# Altium schematic sheet XMOS_TSBOARD_Power.SchDoc
size A3; DocumentNumber: 2; SheetNumber: 2; SheetTotal: 8
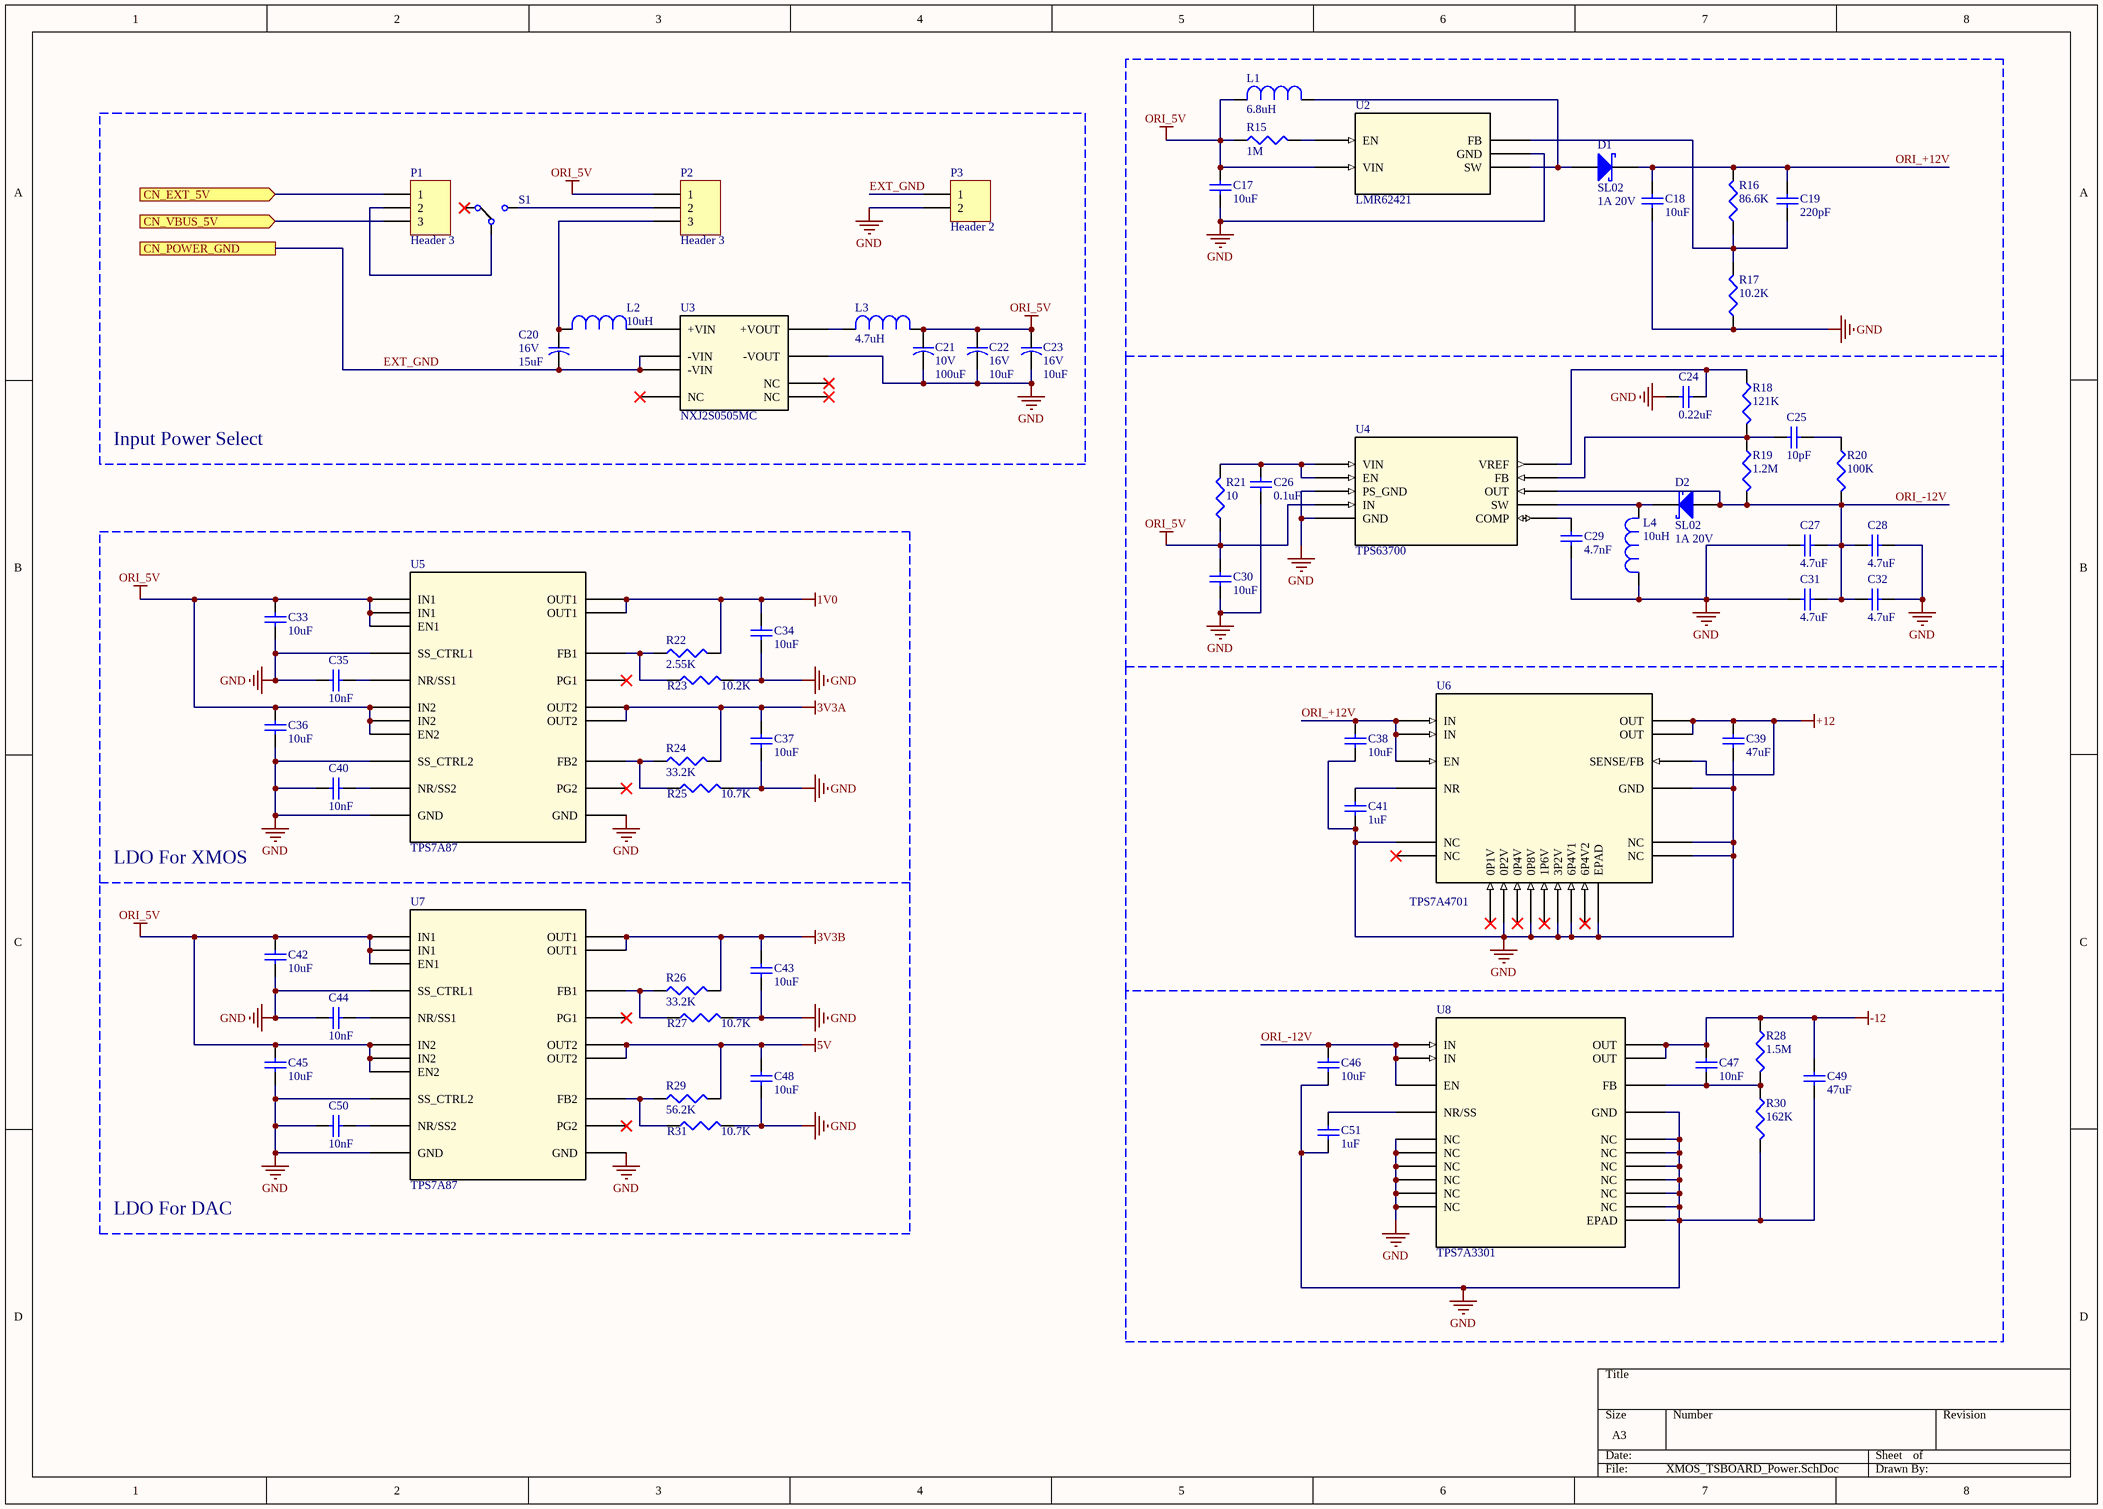
[diagram p0: XMOS_TSBOARD_Power.SchDoc]

## Parts
C17  value 10uF  [1608[0603]]  (hidden comment: Cap Semi)
C18  value 10uF  [C0805]  (hidden comment: Cap Semi)
C19  value 220pF  [1608[0603]]  (hidden comment: Cap Semi)
C20  value 15uF  RatedVoltage: 16V  [3528-21]  (hidden comment: KO-CAP)
C21  value 100uF  RatedVoltage: 10V  [3528-21]  (hidden comment: KO-CAP)
C22  value 10uF  RatedVoltage: 16V  [3528-21]  (hidden comment: KO-CAP)
C23  value 10uF  RatedVoltage: 16V  [3528-21]  (hidden comment: KO-CAP)
C24  value 0.22uF  [1608[0603]]  (hidden comment: Cap Semi)
C25  value 10pF  [1608[0603]]  (hidden comment: Cap Semi)
C26  value 0.1uF  [1608[0603]]  (hidden comment: Cap Semi)
C27  value 4.7uF  [C0805]  (hidden comment: Cap Semi)
C28  value 4.7uF  [C0805]  (hidden comment: Cap Semi)
C29  value 4.7nF  [1608[0603]]  (hidden comment: Cap Semi)
C30  value 10uF  [1608[0603]]  (hidden comment: Cap Semi)
C31  value 4.7uF  [C0805]  (hidden comment: Cap Semi)
C32  value 4.7uF  [C0805]  (hidden comment: Cap Semi)
C33  value 10uF  [1608[0603]]  (hidden comment: Cap Semi)
C34  value 10uF  [1608[0603]]  (hidden comment: Cap Semi)
C35  value 10nF  [1608[0603]]  (hidden comment: Cap Semi)
C36  value 10uF  [1608[0603]]  (hidden comment: Cap Semi)
C37  value 10uF  [1608[0603]]  (hidden comment: Cap Semi)
C38  value 10uF  [C0805]  (hidden comment: Cap Semi)
C39  value 47uF  [C1210]  (hidden comment: Cap Semi)
C40  value 10nF  [1608[0603]]  (hidden comment: Cap Semi)
C41  value 1uF  [1608[0603]]  (hidden comment: Cap Semi)
C42  value 10uF  [1608[0603]]  (hidden comment: Cap Semi)
C43  value 10uF  [1608[0603]]  (hidden comment: Cap Semi)
C44  value 10nF  [1608[0603]]  (hidden comment: Cap Semi)
C45  value 10uF  [1608[0603]]  (hidden comment: Cap Semi)
C46  value 10uF  [C0805]  (hidden comment: Cap Semi)
C47  value 10nF  [1608[0603]]  (hidden comment: Cap Semi)
C48  value 10uF  [1608[0603]]  (hidden comment: Cap Semi)
C49  value 47uF  [C1210]  (hidden comment: Cap Semi)
C50  value 10nF  [1608[0603]]  (hidden comment: Cap Semi)
C51  value 1uF  [1608[0603]]  (hidden comment: Cap Semi)
D1  SL02  value 1A 20V  [DO-219AB]
D2  SL02  value 1A 20V  [DO-219AB]
L1  value 6.8uH  [4240]  (hidden comment: SPM)
L2  value 10uH  [5250]  (hidden comment: SPM)
L3  value 4.7uH  [4240]  (hidden comment: SPM)
L4  value 10uH  [4240]  (hidden comment: SPM)
P1  Header 3  [HDR1X3]
P2  Header 3  [HDR1X3]
P3  Header 2  [HDR1X2]
R15  value 1M  [J1-0603]  (hidden comment: Res3)
R16  value 86.6K  [J1-0603]  (hidden comment: Res3)
R17  value 10.2K  [J1-0603]  (hidden comment: Res3)
R18  value 121K  [J1-0603]  (hidden comment: Res3)
R19  value 1.2M  [J1-0603]  (hidden comment: Res3)
R20  value 100K  [J1-0603]  (hidden comment: Res3)
R21  value 10  [J1-0603]  (hidden comment: Res3)
R22  value 2.55K  [J1-0603]  (hidden comment: Res3)
R23  value 10.2K  [J1-0603]  (hidden comment: Res3)
R24  value 33.2K  [J1-0603]  (hidden comment: Res3)
R25  value 10.7K  [J1-0603]  (hidden comment: Res3)
R26  value 33.2K  [J1-0603]  (hidden comment: Res3)
R27  value 10.7K  [J1-0603]  (hidden comment: Res3)
R28  value 1.5M  [J1-0603]  (hidden comment: Res3)
R29  value 56.2K  [J1-0603]  (hidden comment: Res3)
R30  value 162K  [J1-0603]  (hidden comment: Res3)
R31  value 10.7K  [J1-0603]  (hidden comment: Res3)
S1  SSSS213202  [SS_SMD_213202]  (value not drawn)
U2  LMR62421  [DBV5]
U3  NXJ2S0505MC  [SMD_NXJ2S0505]
U4  TPS63700  [DRC10]
U5  TPS7A87  [RTJ20]
U6  TPS7A4701  [RGW20]
U7  TPS7A87  [RTJ20]
U8  TPS7A3301  [RGW20]

## Blocks framed on the sheet
Input Power Select: C20-C23 L2 L3 P1-P3 S1 U3
LDO For XMOS: C33-C37 C40 R22-R25 U5
LDO For DAC: C42-C45 C48 C50 R26 R27 R29 R31 U7

## Ports
CN_EXT_5V (in), CN_POWER_GND, CN_VBUS_5V (in)

## Nets
1V0: C34.2 R22.2 U5.14(OUT1) U5.15(OUT1)
3V3A: C37.2 R24.2 U5.11(OUT2) U5.12(OUT2)
3V3B: C43.2 R26.2 U7.14(OUT1) U7.15(OUT1)
5V: C48.2 R29.2 U7.11(OUT2) U7.12(OUT2)
+12: C39.2 U6.1(OUT) U6.3(SENSE/FB) U6.20(OUT)
-12: C47.1 C49.2 R28.1 U8.1(OUT) U8.20(OUT)
GND: C17.1 C18.1 C21.2 C22.2 C23.2 C24.2 C26.1 C27.2 C28.1 C29.2 C30.1 C31.2 C32.1 C33.1 C34.1 C35.1 C36.1 C37.1 C38.1 C39.1 C40.1 C41.1 C42.1 C43.1 C44.1 C45.1 C46.1 C48.1 C49.1 C50.1 C51.1 L4.2 P3.2 R17.1 R23.2 R25.2 R27.2 R30.2 R31.2 U2.2(GND) U3.5(-VOUT) U4.2(GND) U4.7(PS_GND) U5.3(GND) U5.8(SS_CTRL2) U5.13(GND) U5.18(SS_CTRL1) U6.5(6P4V1) U6.6(3P2V) U6.7(GND) U6.9(0P8V) U6.11(0P2V) U6.17(NC) U6.18(NC) U6.19(NC) U6.21(EPAD) U7.3(GND) U7.8(SS_CTRL2) U7.13(GND) U7.18(SS_CTRL1) U8.2(NC) U8.4(NC) U8.5(NC) U8.6(NC) U8.7(GND) U8.8(NC) U8.9(NC) U8.10(NC) U8.11(NC) U8.12(NC) U8.17(NC) U8.18(NC) U8.19(NC) U8.21(EPAD)
ORI_5V: C17.2 C21.1 C22.1 C23.1 C30.2 C33.2 C36.2 C42.2 C45.2 L1.2 L3.1 P2.1 R15.1 R21.1 U2.5(VIN) U4.5(IN) U5.1(IN1) U5.2(IN1) U5.4(IN2) U5.5(IN2) U5.6(EN2) U5.20(EN1) U7.1(IN1) U7.2(IN1) U7.4(IN2) U7.5(IN2) U7.6(EN2) U7.20(EN1)
CN_EXT_5V: P1.1 ; port CN_EXT_5V
CN_VBUS_5V: P1.3 ; port CN_VBUS_5V
EXT_GND: C20.2 P3.1 U3.2(-VIN) U3.11(-VIN) ; port CN_POWER_GND
ORI_+12V: C18.2 C19.2 C38.2 D1.2 R16.2 U6.13(EN) U6.15(IN) U6.16(IN)
ORI_-12V: C27.1 C28.2 C31.1 C32.2 C46.2 D2.1 R19.2 R20.2 U4.8(OUT) U8.13(EN) U8.15(IN) U8.16(IN)
NetC19_1: C19.1 R16.1 R17.2 U2.3(FB)
NetC20_1: C20.1 L2.2 P2.3
NetC24_1: C24.1 R18.1 U4.10(VREF)
NetC25_1: C25.1 R20.1
NetC25_2: C25.2 R18.2 R19.1 U4.9(FB)
NetC26_2: C26.2 R21.2 U4.3(VIN) U4.4(EN)
NetC29_1: C29.1 U4.1(COMP)
NetC35_2: C35.2 U5.19(NR/SS1)
NetC40_2: C40.2 U5.7(NR/SS2)
NetC41_2: C41.2 U6.14(NR)
NetC44_2: C44.2 U7.19(NR/SS1)
NetC47_2: C47.2 R28.2 R30.1 U8.3(FB)
NetC50_2: C50.2 U7.7(NR/SS2)
NetC51_2: C51.2 U8.14(NR/SS)
NetD1_1: D1.1 L1.1 U2.1(SW)
NetD2_2: D2.2 L4.1 U4.6(SW)
NetL2_1: L2.1 U3.1(+VIN)
NetL3_2: L3.2 U3.6(+VOUT)
NetP1_2: P1.2 S1.2(COM)
NetP2_2: P2.2 S1.3
NetR15_2: R15.2 U2.4(EN)
NetR22_1: R22.1 R23.1 U5.16(FB1)
NetR24_1: R24.1 R25.1 U5.10(FB2)
NetR26_1: R26.1 R27.1 U7.16(FB1)
NetR29_1: R29.1 R31.1 U7.10(FB2)

Not connected (* = marked no-connect by the designer): S1 1*; U3 7(NC)* 8(NC)* 12(NC)*; U5 9(PG2)* 17(PG1)*; U6 2(NC)* 4(6P4V2)* 8(1P6V)* 10(0P4V)* 12(0P1V)*; U7 9(PG2)* 17(PG1)*

## Library data of the parts
C17-C19 C24-C51 = Cap Semi: Capacitor (Semiconductor SIM Model); Published: 8-Jun-2000; LatestRevisionDate: 29-May-2009; LatestRevisionNote: IPC-7351 Footprint Added.; PackageReference: C1206; Publisher: Altium Limited; PackageDescription: Chip Capacitor
C20-C23 = T520B: Polymer Electrolytic Capacitors
D1 D2 = SL02: Schottky Rectifier
L1 = SPM: Inductors for power circuits, wound metal, SPM series; ManCode: SPM5030-HZ
L2 L3 = SPM: Inductors for power circuits, wound metal, SPM series
L4 = SPM: Inductors for power circuits, wound metal, SPM series; List: SPM5030-HZ
P1 P2 = Header 3: Header, 3-Pin; LatestRevisionDate: 17-Jul-2002; LatestRevisionNote: Re-released for DXP Platform.; Publisher: Altium Limited
P3 = Header 2: Header, 2-Pin; LatestRevisionDate: 17-Jul-2002; LatestRevisionNote: Re-released for DXP Platform.; Publisher: Altium Limited
R15-R31 = Res3: Resistor; Published: 8-Jun-2000; LatestRevisionDate: 29-May-2009; LatestRevisionNote: IPC-7351 Footprint Added.; PackageReference: J1-0603; Publisher: Altium Limited; PackageDescription: Chip Resistor
S1 = SSSS213202: Slide Switch 3.5(H)mm, 2.0mm-travel Type SSSS2 Series
U2 = LMR62421: LMR62421 SIMPLE SWITCHER® 24Vout, 2.1A Step-Up Voltage Regulator in SOT-23
U3 = NXJ2S0505MC: Isolated 2W Single Output SM DC-DC Converters
U4 = TPS63700: DC-DC Inverter
U5 U7 = TPS7A87: Dual, 500-mA, Low-Noise (3.8 μVRMS), LDO Voltage Regulator
U6 = TPS7A4701: TPS7A470x 36-V, 1-A, 4-µVRMS, RF LDO Voltage Regulator
U8 = TPS7A3301: TPS7A33 –36-V, 1-A, Ultralow-Noise Negative Voltage Regulator